# Altium project QWA256_CM5IO_Altium_V2.PrjPcb (part 2 of 2)
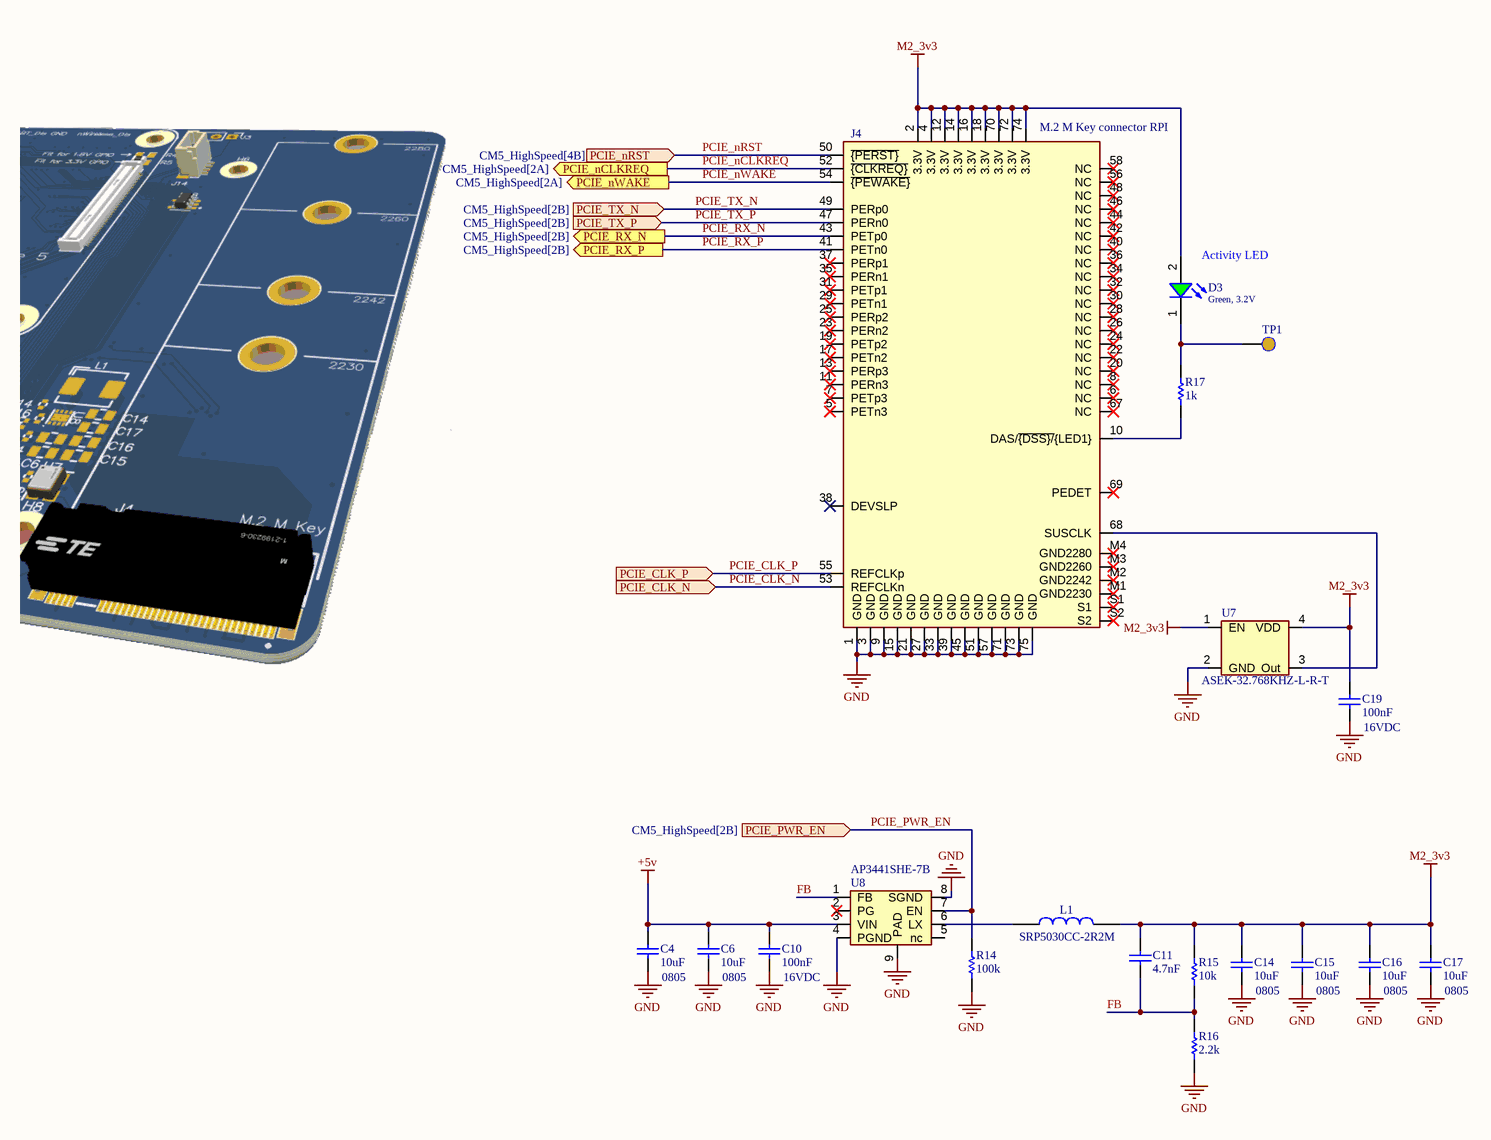
[diagram p3: PCIe-M2.SchDoc]

## Nets that join several sheets
+3.3v: CM5_GPIO (11 pins), CM5_HighSpeed (J5.22 J16.22 R8.1)
+5v: CM5_GPIO (9 pins), CM5_HighSpeed (11 pins), PCIe-M2 (C4.2 C6.2 C10.2 U8.3)
GND: CM5_GPIO (50 pins), CM5_HighSpeed (84 pins), PCIe-M2 (28 pins)
CAM_GPIO0: CM5_GPIO (Module1.97), CM5_HighSpeed (J5.17)
CAM_GPIO1: CM5_GPIO (Module1.100), CM5_HighSpeed (J5.18)
CC1: CM5_GPIO (Module1.94), CM5_HighSpeed (J11.A5)
CC2: CM5_GPIO (Module1.96), CM5_HighSpeed (J11.B5)
GPIO_VREF: CM5_GPIO (Module1.78 R4.2 R5.2), CM5_HighSpeed (R6.2 R7.2)
ID_SC: CM5_GPIO (J8.28 Module1.35), CM5_HighSpeed (J6.1)
ID_SD: CM5_GPIO (J8.27 Module1.36), CM5_HighSpeed (J6.3)
PCIE_CLK_N: CM5_HighSpeed (Module1.112), PCIe-M2 (J4.53)
PCIE_CLK_P: CM5_HighSpeed (Module1.110), PCIe-M2 (J4.55)
PCIE_nCLKREQ: CM5_HighSpeed (Module1.102), PCIe-M2 (J4.52)
PCIE_nRST: CM5_HighSpeed (Module1.109), PCIe-M2 (J4.50)
PCIE_nWAKE: CM5_HighSpeed (Module1.104), PCIe-M2 (J4.54)
PCIE_PWR_EN: CM5_HighSpeed (Module1.106), PCIe-M2 (R14.2 U8.7)
PCIE_RX_N: CM5_HighSpeed (Module1.118), PCIe-M2 (J4.43)
PCIE_RX_P: CM5_HighSpeed (Module1.116), PCIe-M2 (J4.41)
PCIE_TX_N: CM5_HighSpeed (Module1.124), PCIe-M2 (J4.49)
PCIE_TX_P: CM5_HighSpeed (Module1.122), PCIe-M2 (J4.47)
SCL0: CM5_GPIO (Module1.80), CM5_HighSpeed (J5.20)
SDA0: CM5_GPIO (Module1.82), CM5_HighSpeed (J5.21)
USBOTG: CM5_GPIO (J2.10), CM5_HighSpeed (Module1.101)

## Assembly variants
MFG: not fitted J3 R4